# Altium project 2m_DBoard.PrjPcb (part 2 of 2)
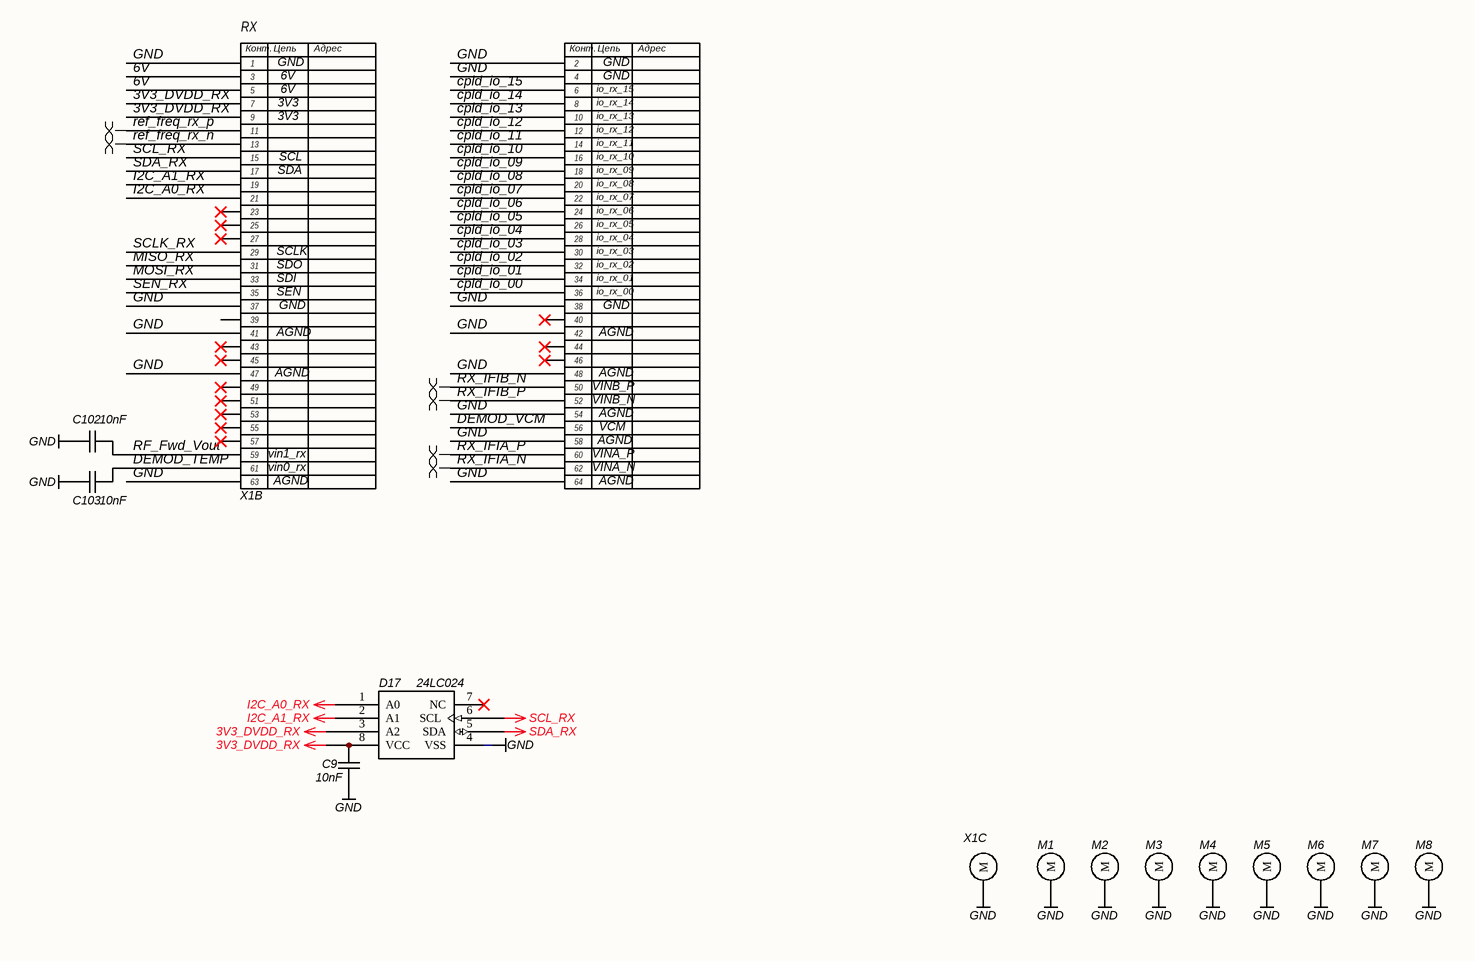
[diagram p5: DBoard_conn.SchDoc]

## Nets that join several sheets
3V3: CPLD (41 pins), RX (H1.2 H2.2), Power (C97.2 C98.2 C99.2 L23.2), IF_RX (7 pins)
3V3_CVDD: Power (C76.1 D11.1), IF_RX (8 pins)
5V_AVDD: RX (C14.2 C15.2 L1.2), Power (C87.1 D13.1)
5V_CVDD: Power (C83.1 D12.1), IF_RX (C63.1 D8.23 R31.2)
5V_DEMOD: Power (C101.1 D10.1), IF_RX (C36.1 C37.2 D7.18 R11.1)
6V: Power (9 pins), DBoard_conn (X1.67 X1.69)
12V_AVDD: RX (7 pins), Power (C70.2 C71.2 C72.2 L19.2)
_3V3_flt: RX (13 pins), Power (C90.2 C91.2 C92.2 L22.2), IF_RX (C62.1 D9.8)
ATT1_RX_C1: CPLD (D16.C16), RX (D4.11)
ATT1_RX_C2: CPLD (D16.B16), RX (D4.10)
ATT2_MOSI_RX: CPLD (R91.5), RX (D6.18)
ATT2_RX_LE: CPLD (R91.7), RX (D6.16)
ATT2_SCLK_RX: CPLD (R91.6), RX (D6.17)
cpld_io_00: CPLD (R90.2), DBoard_conn (X1.100)
cpld_io_01: CPLD (R89.6), DBoard_conn (X1.98)
cpld_io_02: CPLD (R89.7), DBoard_conn (X1.96)
cpld_io_03: CPLD (R89.8), DBoard_conn (X1.94)
cpld_io_04: CPLD (R87.5), DBoard_conn (X1.92)
cpld_io_05: CPLD (R87.6), DBoard_conn (X1.90)
cpld_io_06: CPLD (R87.7), DBoard_conn (X1.88)
cpld_io_07: CPLD (R87.8), DBoard_conn (X1.86)
cpld_io_08: CPLD (R84.5), DBoard_conn (X1.84)
cpld_io_09: CPLD (R84.6), DBoard_conn (X1.82)
cpld_io_10: CPLD (R84.7), DBoard_conn (X1.80)
cpld_io_11: CPLD (R84.8), DBoard_conn (X1.78)
cpld_io_12: CPLD (R82.5), DBoard_conn (X1.76)
cpld_io_13: CPLD (R82.6), DBoard_conn (X1.74)
cpld_io_14: CPLD (R82.7), DBoard_conn (X1.72)
cpld_io_15: CPLD (R82.8), DBoard_conn (X1.70)
CS_LTC6948: CPLD (R81.8), IF_RX (D8.3)
DEMOD_TEMP: IF_RX (C35.1 D7.2 D9.6 R11.2), DBoard_conn (C103.2 X1.125)
DEMOD_VCM: IF_RX (R9.1), DBoard_conn (X1.120)
GND: CPLD (47 pins), RX (59 pins), Power (55 pins), IF_RX (57 pins), DBoard_conn (26 pins)
IFreq_Ampd_RX: RX (D6.14), IF_RX (C24.1 C27.2)
LED_RX: CPLD (D16.L16), RX (T2.1)
MISO_LTC5594: CPLD (R80.5), IF_RX (D7.21)
MISO_LTC6948: CPLD (R81.5), IF_RX (D8.6)
MISO_RX: CPLD (R79.7), DBoard_conn (X1.95)
MOSI_LTC5594: CPLD (R80.6), IF_RX (D7.22)
MOSI_LTC6948: CPLD (R81.6), IF_RX (D8.5)
MOSI_RX: CPLD (R79.6), DBoard_conn (X1.97)
ref_freq_rx_n: IF_RX (D8.28 R20.1), DBoard_conn (X1.77)
ref_freq_rx_p: IF_RX (D8.1 R20.2), DBoard_conn (X1.75)
RF_Fwd_Vout: RX (C3.2 D1.5 D2.3), DBoard_conn (C102.2 X1.123)
RX_IFIA_N: IF_RX (C56.2 L17.2 R28.2), DBoard_conn (X1.126)
RX_IFIA_P: IF_RX (C49.1 L14.2 R22.1), DBoard_conn (X1.124)
RX_IFIB_N: IF_RX (C43.2 L10.2 R18.2), DBoard_conn (X1.114)
RX_IFIB_P: IF_RX (C39.1 L8.2 R13.1), DBoard_conn (X1.116)
SCLK_AD7922: CPLD (R86.2), RX (D1.3)
SCLK_AD7922_2: CPLD (R88.6), IF_RX (D9.3)
SCLK_LTC5594: CPLD (R80.7), IF_RX (D7.23)
SCLK_LTC6948: CPLD (R81.7), IF_RX (D8.4)
SCLK_RX: CPLD (R79.8), DBoard_conn (X1.93)
SDI_AD7922: CPLD (R86.1), RX (D1.4)
SDI_AD7922_2: CPLD (R88.5), IF_RX (D9.4)
SDO_AD7922: CPLD (R86.4), RX (D1.1)
SDO_AD7922_2: CPLD (R88.8), IF_RX (D9.1)
SEN_AD7922: CPLD (R86.3), RX (D1.2)
SEN_AD7922_2: CPLD (R88.7), IF_RX (D9.2)
SEN_LTC5594: CPLD (D16.B6), IF_RX (D7.17)
SEN_RX: CPLD (R79.5), DBoard_conn (X1.99)
STAT_LTC6948: CPLD (D16.T6), IF_RX (C61.1 D8.2 T3.1)
TPS_EN: CPLD (D16.K16), RX (T1.1), Power (D14.11)